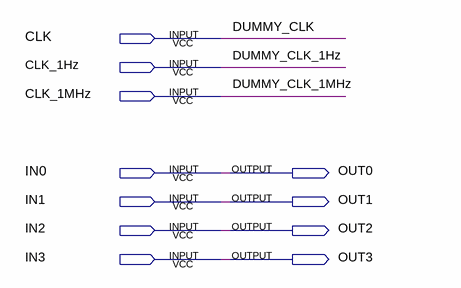
[diagram p0: schematic sheet]
// Quartus schematic BLOCK_DIAGRAM_START.bdf as structural Verilog: 0 symbols, 11 pins
module BLOCK_DIAGRAM_START (
  input  CLK,
  input  CLK_1Hz,
  input  CLK_1MHz,
  input  IN0,
  input  IN1,
  input  IN2,
  input  IN3,
  output OUT0,
  output OUT1,
  output OUT2,
  output OUT3
);


  assign OUT0 = IN0;
  assign OUT1 = IN1;
  assign OUT2 = IN2;
  assign OUT3 = IN3;

  // Other names for the same wires on the sheet: DUMMY_CLK = CLK; DUMMY_CLK_1Hz = CLK_1Hz; DUMMY_CLK_1MHz = CLK_1MHz
endmodule
